# EAGLE design rapidshark-motor-connector-mk-1.1 (EAGLE 6.5.0)
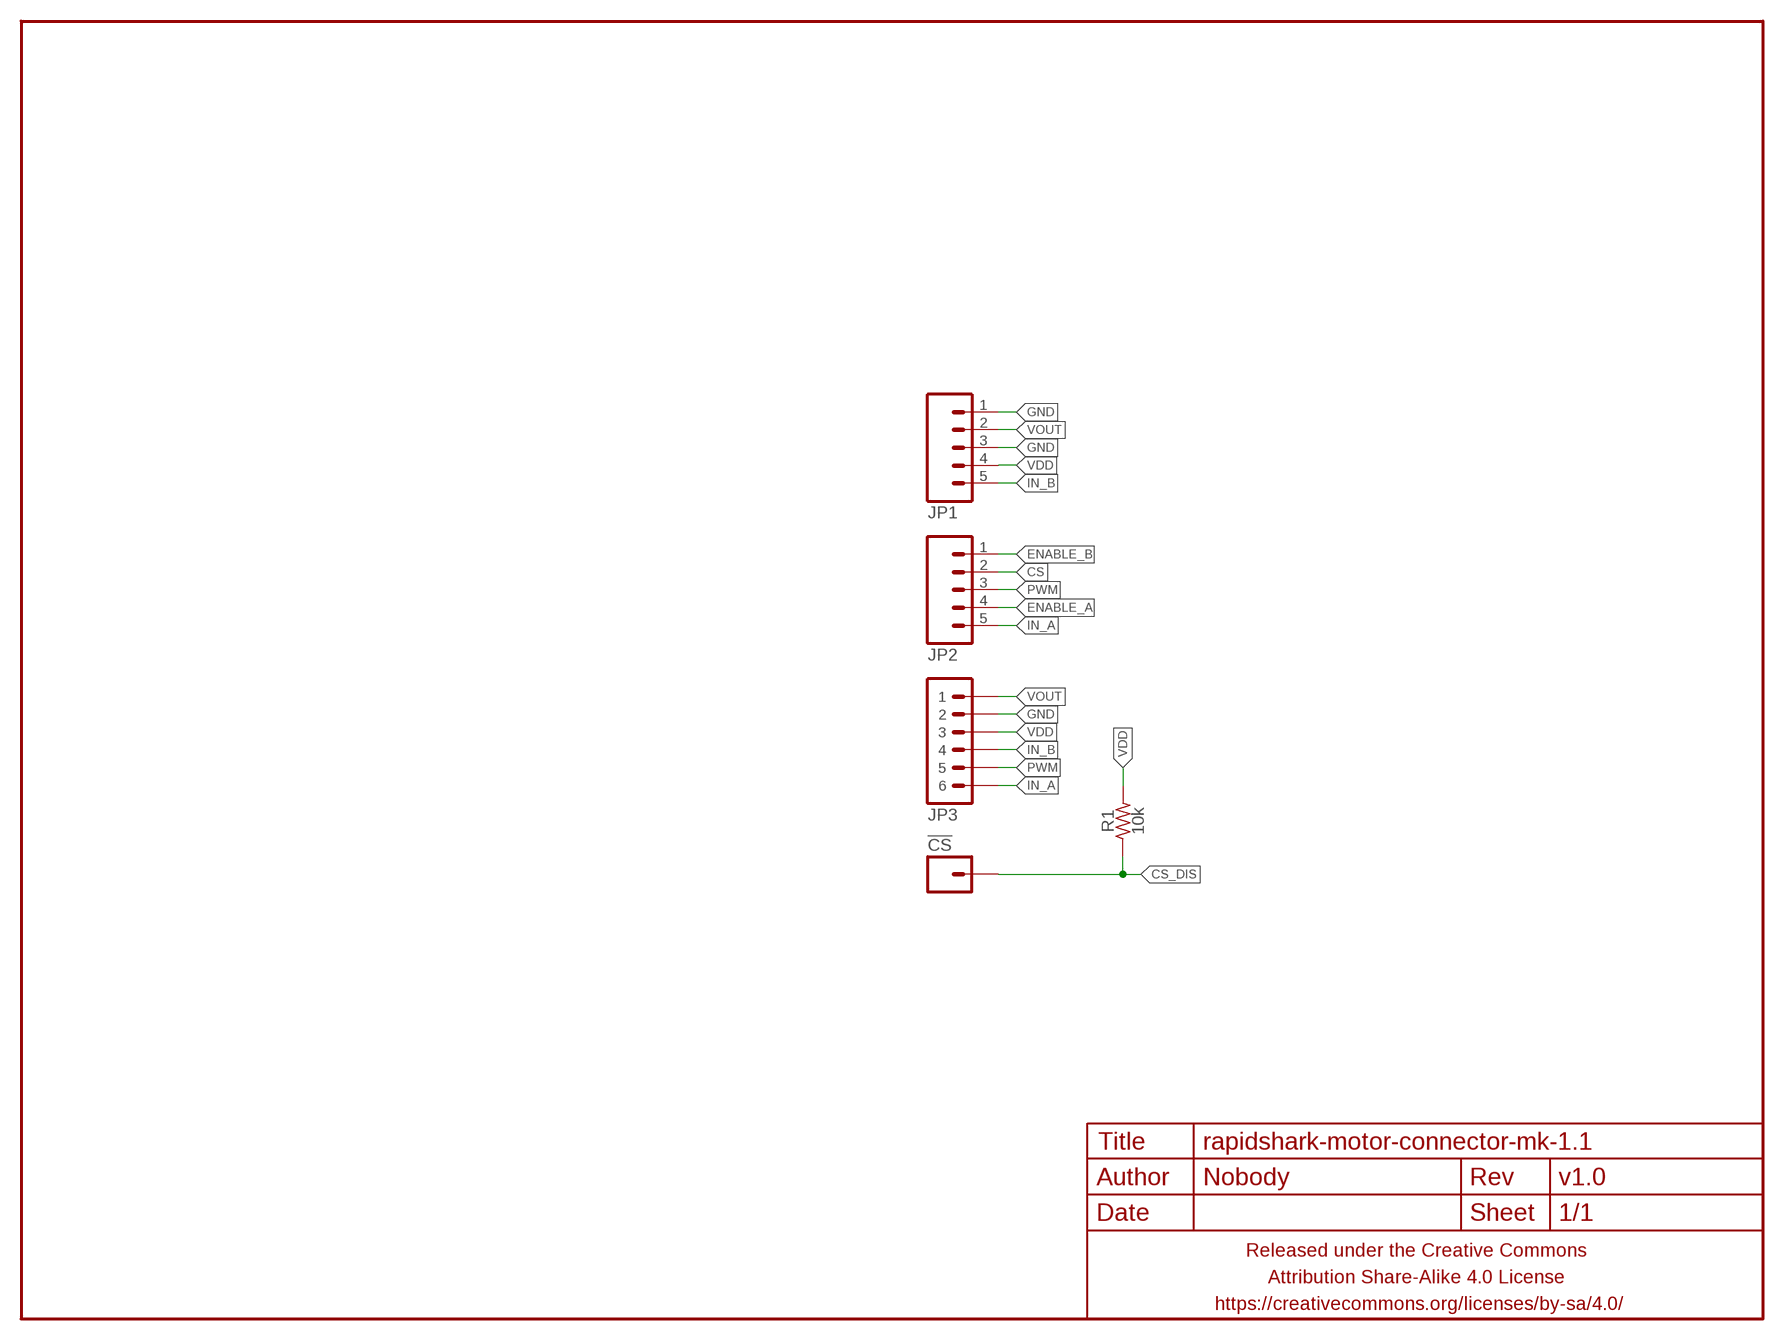
[diagram p0: schematic, sheet 1]

## Parts
!CS  M01PTH  [1X01]
FRAME1  FRAME-LETTERNO_PACKAGE  [DUMMY]
JP1  M05PTH  [1X05]
JP2  M05PTH  [1X05]
JP3  M06JST-PH-PTH-RA  [JST-6-PH-RA-PTH]
R1  10k  RESISTORPTH-AXIAL-5.08MM  [RESISTOR-AXIAL-PTH-5.08MM]

## Nets
CS: JP2.2
CS_DIS: !CS.1 R1.P$1
ENABLE_A: JP2.4
ENABLE_B: JP2.1
GND: JP1.1 JP1.3 JP3.2
IN_A: JP2.5 JP3.6
IN_B: JP1.5 JP3.4
PWM: JP2.3 JP3.5
VDD: JP1.4 JP3.3 R1.P$2
VOUT: JP1.2 JP3.1

## Library data of the parts
!CS = A_butts:M01: Header 1 Standard 1-pin 0.1" header. Use with straight break away headers (SKU : PRT-00116), right angle break away headers (PRT-00553), swiss pins (PRT-00743), machine pins (PRT-00117), and female headers (PRT-00115).
FRAME1 = A_butts:FRAME-LETTER: Schematic Frame Standard 8.5x11 US Letter frame; DESIGNER: Nobody; VERSION: v1.0
JP1 JP2 = A_butts:M05: Header 5 Standard 5-pin 0.1" header. Use with straight break away headers (SKU : PRT-00116), right angle break away headers (PRT-00553), swiss pins (PRT-00743), machine pins (PRT-00117), and female headers (PRT-00115). Molex polarized connector foot print use with SKU : PRT-08230 with associated crimp pins and housings.
JP3 = A_butts:M06: Header 6 Standard 6-pin 0.1" header. Use with straight break away headers (SKU : PRT-00116), right angle break away headers (PRT-00553), swiss pins (PRT-00743), machine pins (PRT-00117), and female headers (PRT-00115). Molex polarized connector foot print use with SKU : PRT-08094 with associated crimp pins and housings. NOTES ON THE VARIANTS LOCK and LOCK_LONGPADS... This footprint was designed to help hold the alignment of a through-hole component (i.e. 6-pin header) while soldering it into place. You may notice that each hole has been shifted either up or down by 0.005 of an inch from it's more standard position (which is a perfectly straight line). This slight alteration caused the pins (the squares in the middle) to touch the edges of the holes. Because they are alternating, it causes a "brace" to hold the component in place. 0.005 has proven to be the perfect amount of "off-center" position when using our standard breakaway headers. Although looks a little odd when you look at the bare footprint, once you have a header in there, the alteration is very hard to notice. Also,if you push a header all the way into place, it is covered up entirely on the bottom side. This idea of altering the position of holes to aid alignment will be further integrated into the Sparkfun Library for other footprints. It can help hold any component with 3 or more connection pins.
R1 = A_butts:RESISTOR: RESISTOR, American symbol

## Board
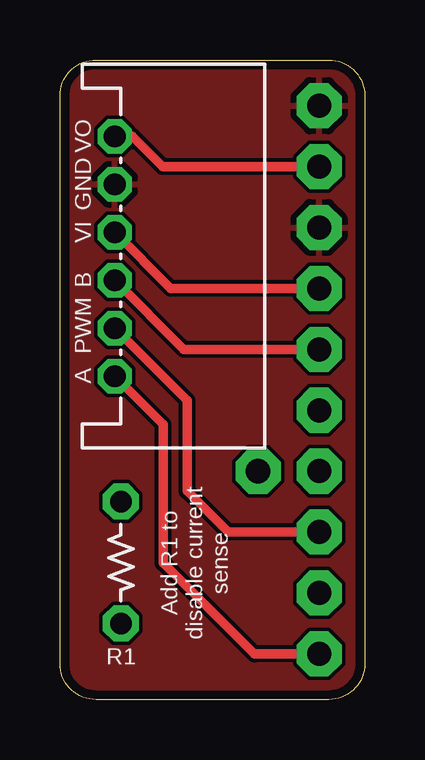
[diagram p1: board, top side]
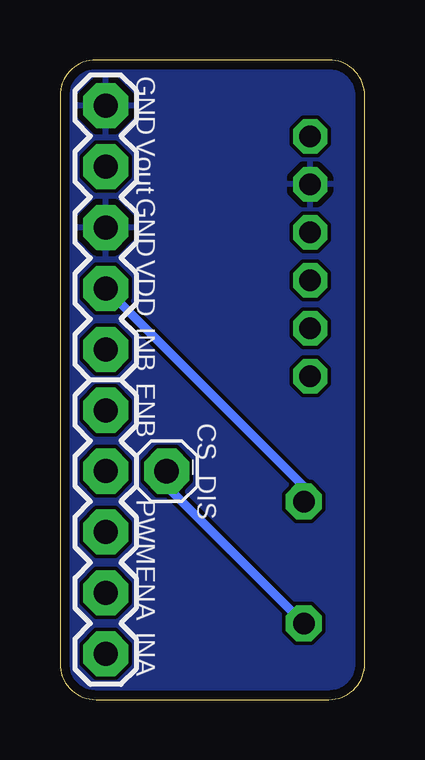
[diagram p2: board, bottom side, seen from below]

Size 12.7 x 26.67 mm. Coordinates in mm from the lower left corner, seen from the top.
Outline: 11.2,0 1.5,0 arc-90 0,1.5 0,25.17 arc-90 1.5,26.67 11.2,26.67 arc-90 12.7,25.17 12.7,1.5 arc-90 11.2,0
Copper layers (1*16): Top 0.0356mm / dielectric 1.5011mm / Bottom 0.0356mm
Design rules "LaenPCBOrder_2": minimum track width 6mil, minimum drill 13mil, track to track 6mil, track to pad 6mil, pad to pad 6mil, via to via 6mil, smd to smd 6mil, copper to edge 15mil, drill to drill 6mil, minimum pad ring 7mil, minimum via ring 7mil, stop-mask expansion 3mil, vias tented up to drill 20mil, thermal gap 10mil

### Footprints (pad centres in the part's own frame; a part is rotated, then mirrored left to right if it is on the bottom)
1X01 = drill 1.016 pad 1.88 octagon: 1 0,0
1X05 = drill 1 pad 1.88 octagon: 1 0,0; 2 2.54,0; 3 5.08,0; 4 7.62,0; 5 10.16,0
JST-6-PH-RA-PTH = drill 0.9 pad 1.422 octagon: 1 -5,0; 2 -3,0; 3 -1,0; 4 1,0; 5 3,0; 6 5,0
RESISTOR-AXIAL-PTH-5.08MM = drill 0.9 pad 1.5 octagon: P$1 -2.54,0; P$2 2.54,0

### Placement (x,y rotation side)
!CS  8.26,9.53 270 bottom
FRAME1  0,0 0 bottom
JP1  10.79,24.77 270 bottom
JP2  10.79,12.06 270 bottom
JP3  2.28,18.48 270 top
R1  2.54,5.71 90 top

### Tracks (layer width: path | path; a pad name or v marks a point on that pad's centre or on a via)
CS_DIS
  Bottom 0.4: !CS.1 8.26,8.89 R1.P$1
GND
  pour Top: 0,0 0,26.67 12.7,26.67 12.7,0
  pour Bottom: 0,0 0,26.67 12.7,26.67 12.7,0
IN_A
  Top 0.4: JP2.5 8.1,1.91 4.3,5.7 4.3,11.46 JP3.6
IN_B
  Top 0.4: JP1.5 5.16,14.61 JP3.4
PWM
  Top 0.4: JP2.3 7.01,6.99 5.3,8.7 5.3,12.46 JP3.5
VDD
  Top 0.4: JP1.4 4.62,17.14 JP3.3
  Bottom 0.4: R1.P$2 2.54,8.89 JP1.4
VOUT
  Top 0.4: JP1.2 4.28,22.23 3.02,23.48 JP3.1

### Text on the board
tPlace: VO | GND | VI | B | PWM | A | Add R1 to / disable current / sense
bPlace: GND | Vout | GND | VDD | INB | ENB | CS_DIS | PWM | ENA | INA